# EAGLE design legatus_0_1 (EAGLE 9.6.2)
CNAME: Parrot Teensy Board; CREVISION: 1.0; DESIGNER: Nathan Villicana-Shaw

## Sheet 1 of 2
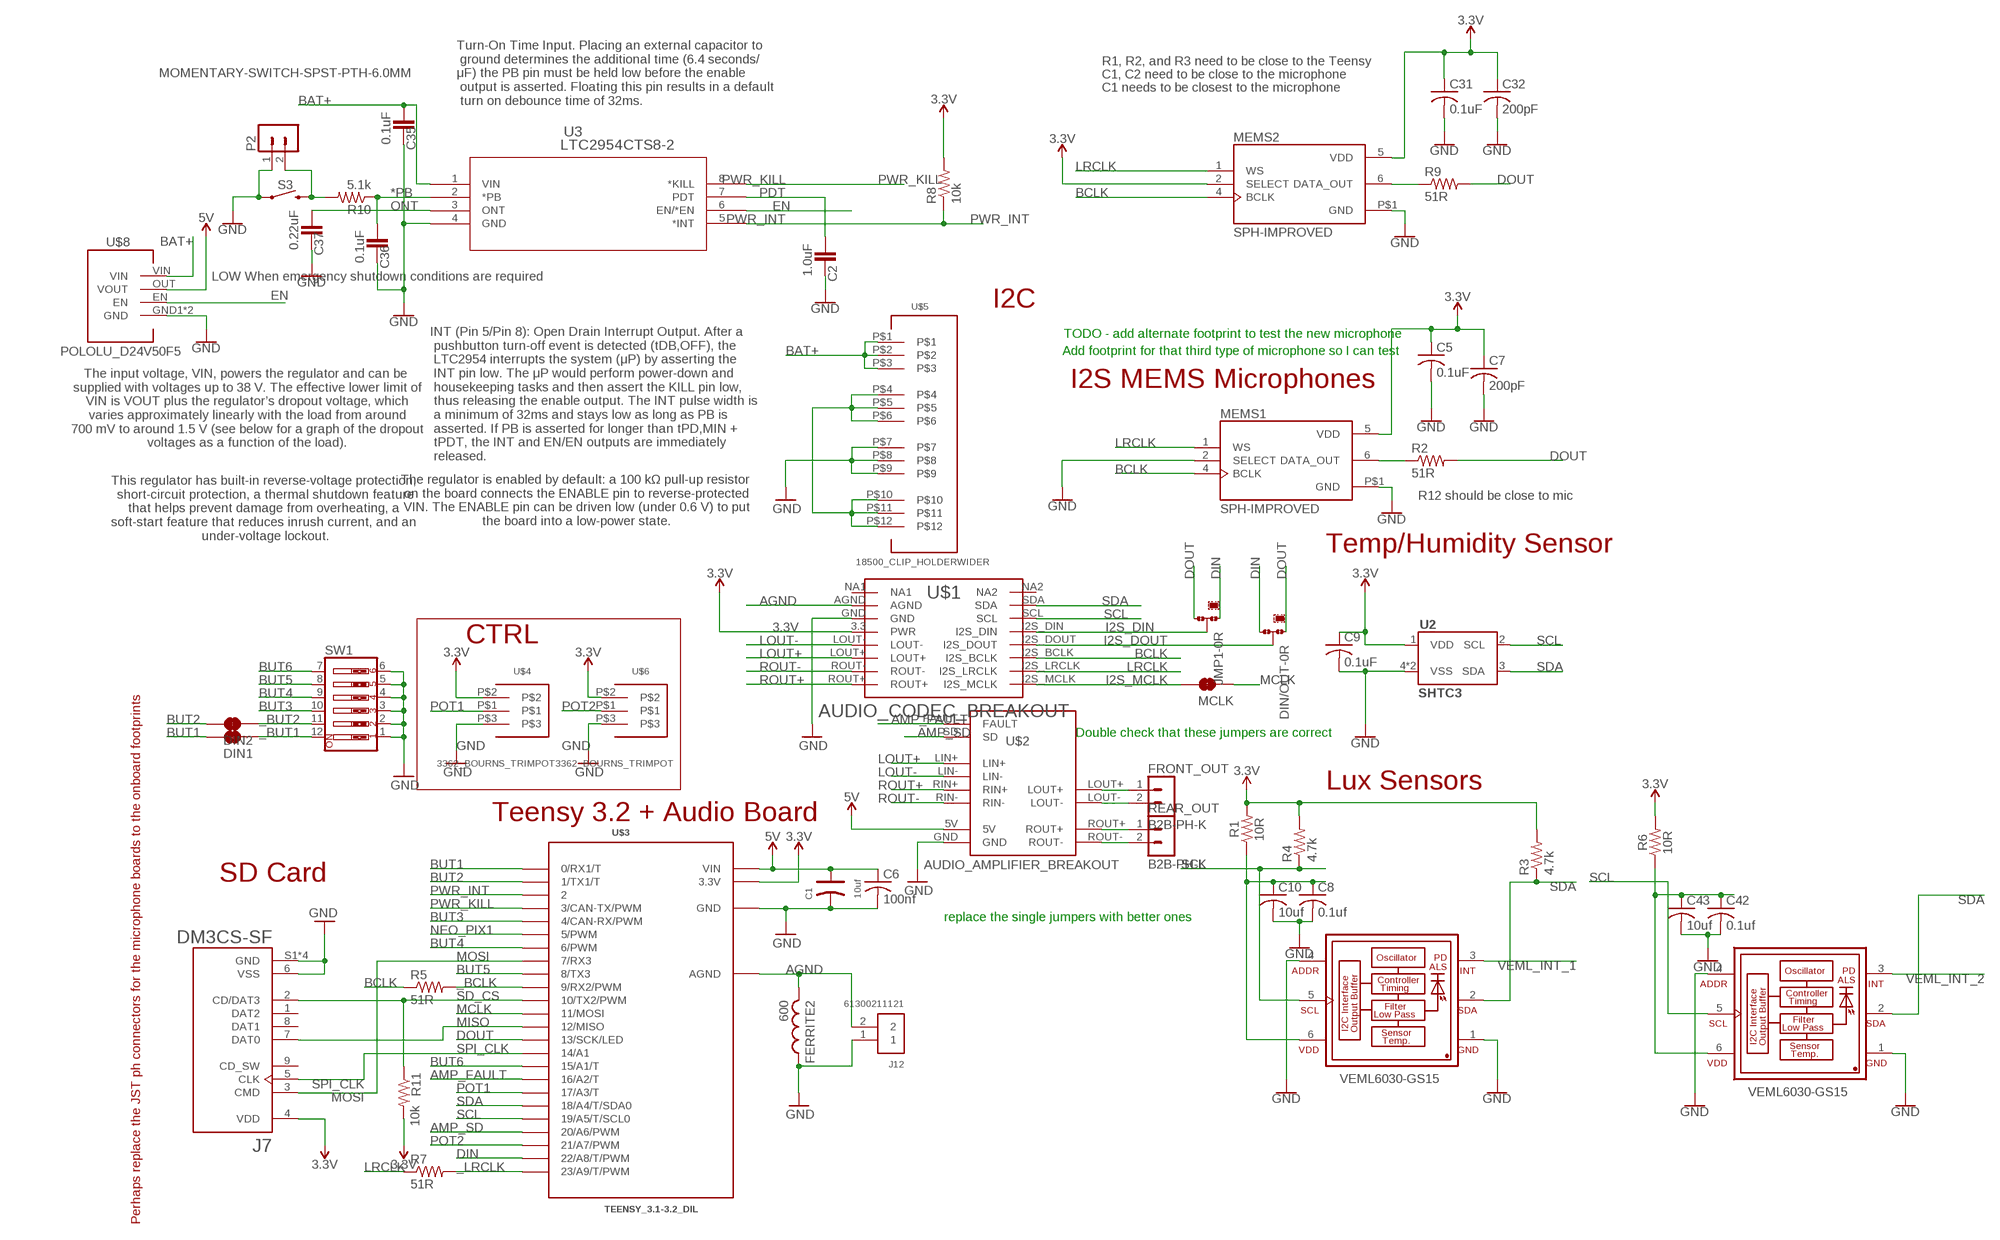
[diagram p0: schematic, sheet 1]

### Parts
C1  10uf  DIP-ALUMINUM-47UF-16V(D5-H7MM)  [PC-D5.3MM]
C2  1.0uF  C_CHIP-0805(2012-METRIC)  [CAPC2012X110]
C5  0.1uF  C-USC0805  [C0805]
C6  100nf  C-USC2012  [C2012]
C7  200pF  C-USC0805  [C0805]
C8  0.1uf  C-USC0805  [C0805]
C9  0.1uF  C-USC0805  [C0805]
C10  10uf  C-USC0805  [C0805]
C31  0.1uF  C-USC0805  [C0805]
C32  200pF  C-USC0805  [C0805]
C35  0.1uF  C_CHIP-0805(2012-METRIC)  [CAPC2012X110]
C36  0.1uF  C_CHIP-0805(2012-METRIC)  [CAPC2012X110]
C37  0.22uF  C_CHIP-0805(2012-METRIC)  [CAPC2012X110]
C42  0.1uf  C-USC0805  [C0805]
C43  10uf  C-USC0805  [C0805]
DIN1  JUMPER-SMT_2_NC_TRACE_SILK  [SMT-JUMPER_2_NC_TRACE_SILK]
DIN2  JUMPER-SMT_2_NC_TRACE_SILK  [SMT-JUMPER_2_NC_TRACE_SILK]
DIN/OUT  0R-JUMPB  [B0R-JMP]
FERRITE2  600  INDUCTOR_0805_N  [RESC0805_N]
FRONT_OUT  B2B-PH-K  [B2B-PH-K]
J7  DM3CS-SF  [HRS_DM3CS-SF]
J12  61300211121  [61300211121]
JMP1  0R-JUMPB  [B0R-JMP]
MCLK  JUMPER-SMT_2_NC_TRACE_SILK  [SMT-JUMPER_2_NC_TRACE_SILK]
MEMS1  SPH-IMPROVED  [MIC_SPH0645LM4H-B_LARGER_RING]
MEMS2  SPH-IMPROVED  [MIC_SPH0645LM4H-B_LARGER_RING]
P2  B2B-PH-K  [B2B-PH-K]
R1  10R  R-US_R0805  [R0805]
R2  51R  R-US_M0805  [M0805]
R3  4.7k  R-US_M0805  [M0805]
R4  4.7k  R-US_M0805  [M0805]
R5  51R  R-US_M0805  [M0805]
R6  10R  R-US_R0805  [R0805]
R7  51R  R-US_M0805  [M0805]
R8  10k  R-US_R0805  [R0805]
R9  51R  R-US_M0805  [M0805]
R10  5.1k  R-US_R0805  [R0805]
R11  10k  R-US_M0805  [M0805]
REAR_OUT  B2B-PH-K  [B2B-PH-K]
S3  MOMENTARY-SWITCH-SPST-PTH-6.0MM  [TACTILE_SWITCH_PTH_6.0MM]
SW1  SW_DIP-6  [EDG-06]
U2  SHTC3  [SHTC3]
U3  LTC2954CTS8-2  [TSOT-23_TS8]
U$1  AUDIO_CODEC_BREAKOUT  [HSS_CODEC_BREAKOUT]
U$2  AUDIO_AMPLIFIER_BREAKOUT  [AUDIO_AMPLIFIER_BREAKOUT]
U$3  TEENSY_3.1-3.2_DIL  [TEENSY_3.0-3.2&LC_DIL]
U$4  3362_BOURNS_TRIMPOT  [3362_BOURNS_TRIMPOT]
U$5  18500_CLIP_HOLDERWIDER  [3PINBATTERY_CLIP_WIDER]
U$6  3362_BOURNS_TRIMPOT  [3362_BOURNS_TRIMPOT]
U$8  POLOLU_D24V50F5  [POLOLU_D24V50F5]
VMEL1  VEML6030-GS15  [VISHAY_VEML6030_2X2X0.87]
VMEL2  VEML6030-GS15  [VISHAY_VEML6030_2X2X0.87]

### Nets
3.3V [3.3V]: C5.1 C7.1 C9.1 C31.1 C32.1 J7.4(VDD) MEMS1.5(VDD) MEMS2.2(SELECT) MEMS2.5(VDD) R1.2 R3.2 R4.2 R6.2 R8.2 R11.2 U2.1(VDD) U$1.3.3(PWR) U$3.3.3V U$4.P$2 U$6.P$2
5V: C1.+ C6.1 U$2.5V U$3.VIN U$8.OUT(VOUT) ; also sheet 2
*PB: P2.2 R10.2 S3.3
_BCLK: R5.2 U$3.9(9/RX2/PWM)
_BUT1: DIN1.2 SW1.12
_BUT2: DIN2.2 SW1.11
_LRCLK: R7.2 U$3.23/A9(23/A9/T/PWM)
AGND [AGND]: FERRITE2.2 J12.2 U$1.AGND U$3.AGND
AMP_FAULT: U$2.FAULT U$3.16/A2(16/A2/T)
AMP_SD: U$2.SD U$3.20/A6(20/A6/PWM)
BAT+: C35.1 U3.1(VIN) U$5.P$1 U$5.P$2 U$5.P$3 U$8.VIN
BCLK: MEMS1.4(BCLK) MEMS2.4(BCLK) R5.1 U$1.I2S_BCLK
BUT1: DIN1.1 U$3.0(0/RX1/T)
BUT2: DIN2.1 U$3.1(1/TX1/T)
BUT3: SW1.10 U$3.4(4/CAN-RX/PWM)
BUT4: SW1.9 U$3.6(6/PWM)
BUT5: SW1.8 U$3.8(8/TX3)
BUT6: SW1.7 U$3.15/A1(15/A1/T)
DIN: DIN/OUT.3 JMP1.1 U$3.22/A8(22/A8/T/PWM)
DOUT: DIN/OUT.1 JMP1.3 R2.2 R9.2 U$3.13(13/SCK/LED)
EN: U3.6(EN/*EN) U$8.EN
GND: C1.- C2.2 C5.2 C6.2 C7.2 C8.2 C9.2 C10.2 C31.2 C32.2 C35.2 C36.2 C37.2 C42.2 C43.2 FERRITE2.1 J7.6(VSS) J7.S1(GND) J7.S2(GND) J7.S3(GND) J7.S5(GND) J12.1 MEMS1.2(SELECT) MEMS1.P$1(GND) MEMS2.P$1(GND) P2.1 S3.1 SW1.1 SW1.2 SW1.3 SW1.4 SW1.5 SW1.6 U2.4(VSS) U2.5(VSS) U3.4(GND) U$1.GND U$2.GND U$3.GND U$4.P$3 U$5.P$7 U$5.P$8 U$5.P$9 U$6.P$3 U$8.GND1(GND) U$8.GND2(GND) VMEL1.1(GND) VMEL1.4(ADDR) VMEL2.1(GND) VMEL2.4(ADDR) ; also sheet 2
I2S_DIN: JMP1.2 U$1.I2S_DIN
I2S_DOUT: DIN/OUT.2 U$1.I2S_DOUT
I2S_MCLK: MCLK.1 U$1.I2S_MCLK
LOUT+: U$1.LOUT+ U$2.LIN+
LOUT-: U$1.LOUT- U$2.LIN-
LRCLK: MEMS1.1(WS) MEMS2.1(WS) R7.1 U$1.I2S_LRCLK
MCLK: MCLK.2 U$3.11(11/MOSI)
MISO: J7.7(DAT0) U$3.12(12/MISO)
MOSI: J7.3(CMD) U$3.7(7/RX3)
N$1: MEMS1.6(DATA_OUT) R2.1
N$2: U$5.P$4 U$5.P$5 U$5.P$6 U$5.P$10 U$5.P$11 U$5.P$12
N$4: C8.1 C10.1 R1.1 VMEL1.6(VDD)
N$6: C36.1 R10.1 U3.2(*PB)
N$28: MEMS2.6(DATA_OUT) R9.1
N$30: REAR_OUT.2 U$2.ROUT-
N$31: REAR_OUT.1 U$2.ROUT+
N$32: FRONT_OUT.2 U$2.LOUT-
N$33: FRONT_OUT.1 U$2.LOUT+
N$41: C42.1 C43.1 R6.1 VMEL2.6(VDD)
NEO_PIX1: U$3.5(5/PWM) ; also sheet 2
ONT: C37.1 U3.3(ONT)
PDT: C2.1 U3.7(PDT)
POT1: U$3.17/A3(17/A3/T) U$4.P$1
POT2: U$3.21/A7(21/A7/PWM) U$6.P$1
PWR_INT: R8.1 U3.5(*INT) U$3.2
PWR_KILL: U3.8(*KILL) U$3.3(3/CAN-TX/PWM)
ROUT+: U$1.ROUT+ U$2.RIN+
ROUT-: U$1.ROUT- U$2.RIN-
SCL: R4.1 U2.2(SCL) U$1.SCL U$3.19/A5(19/A5/T/SCL0) VMEL1.5(SCL) VMEL2.5(SCL)
SD_CS: J7.2(CD/DAT3) R11.1 U$3.10(10/TX2/PWM)
SDA: R3.1 U2.3(SDA) U$1.SDA U$3.18/A4(18/A4/T/SDA0) VMEL1.2(SDA) VMEL2.2(SDA)
SPI_CLK: J7.5(CLK) U$3.14/A0(14/A1)
VEML_INT_1: VMEL1.3(INT)
VEML_INT_2: VMEL2.3(INT)
Unconnected: J7.1(DAT2) J7.8(DAT1) J7.9(CD_SW) U$1.NA1 U$1.NA2

### Notes on the sheet
- R1, R2, and R3 need to be close to the Teensy
- C1, C2 need to be close to the microphone
- C1 needs to be closest to the microphone
- Turn-On Time Input. Placing an external capacitor to
   ground determines the additional time (6.4 seconds/
  μF) the PB pin must be held low before the enable
   output is asserted. Floating this pin results in a default
   turn on debounce time of 32ms.
- LOW When emergency shutdown conditions are required
- I2C
- TODO - add alternate footprint to test the new microphone
- Add footprint for that third type of microphone so I can test
- I2S MEMS Microphones
- The input voltage, VIN, powers the regulator and can be
   supplied with voltages up to 38 V. The effective lower limit of
   VIN is VOUT plus the regulator’s dropout voltage, which
   varies approximately linearly with the load from around
   700 mV to around 1.5 V (see below for a graph of the dropout
   voltages as a function of the load).
- INT (Pin 5/Pin 8): Open Drain Interrupt Output. After a
   pushbutton turn-off event is detected (tDB,OFF), the
   LTC2954 interrupts the system (μP) by asserting the
   INT pin low. The μP would perform power-down and
   housekeeping tasks and then assert the KILL pin low,
   thus releasing the enable output. The INT pulse width is
   a minimum of 32ms and stays low as long as PB is
   asserted. If PB is asserted for longer than tPD,MIN +
   tPDT, the INT and EN/EN outputs are immediately
   released.
- The regulator is enabled by default: a 100 kΩ pull-up resistor
   on the board connects the ENABLE pin to reverse-protected
   VIN. The ENABLE pin can be driven low (under 0.6 V) to put
   the board into a low-power state.
- R12 should be close to mic
- This regulator has built-in reverse-voltage protection, 
  short-circuit protection, a thermal shutdown feature
  that helps prevent damage from overheating, a 
  soft-start feature that reduces inrush current, and an 
  under-voltage lockout.
- Temp/Humidity Sensor
- CTRL
- Double check that these jumpers are correct
- Lux Sensors
- Teensy 3.2 + Audio Board
- 10R
- 10R
- SD Card
- replace the single jumpers with better ones
- Perhaps replace the JST ph connectors for the microphone boards to the onboard footprints

## Sheet 2 of 2: Neopixel LEDs
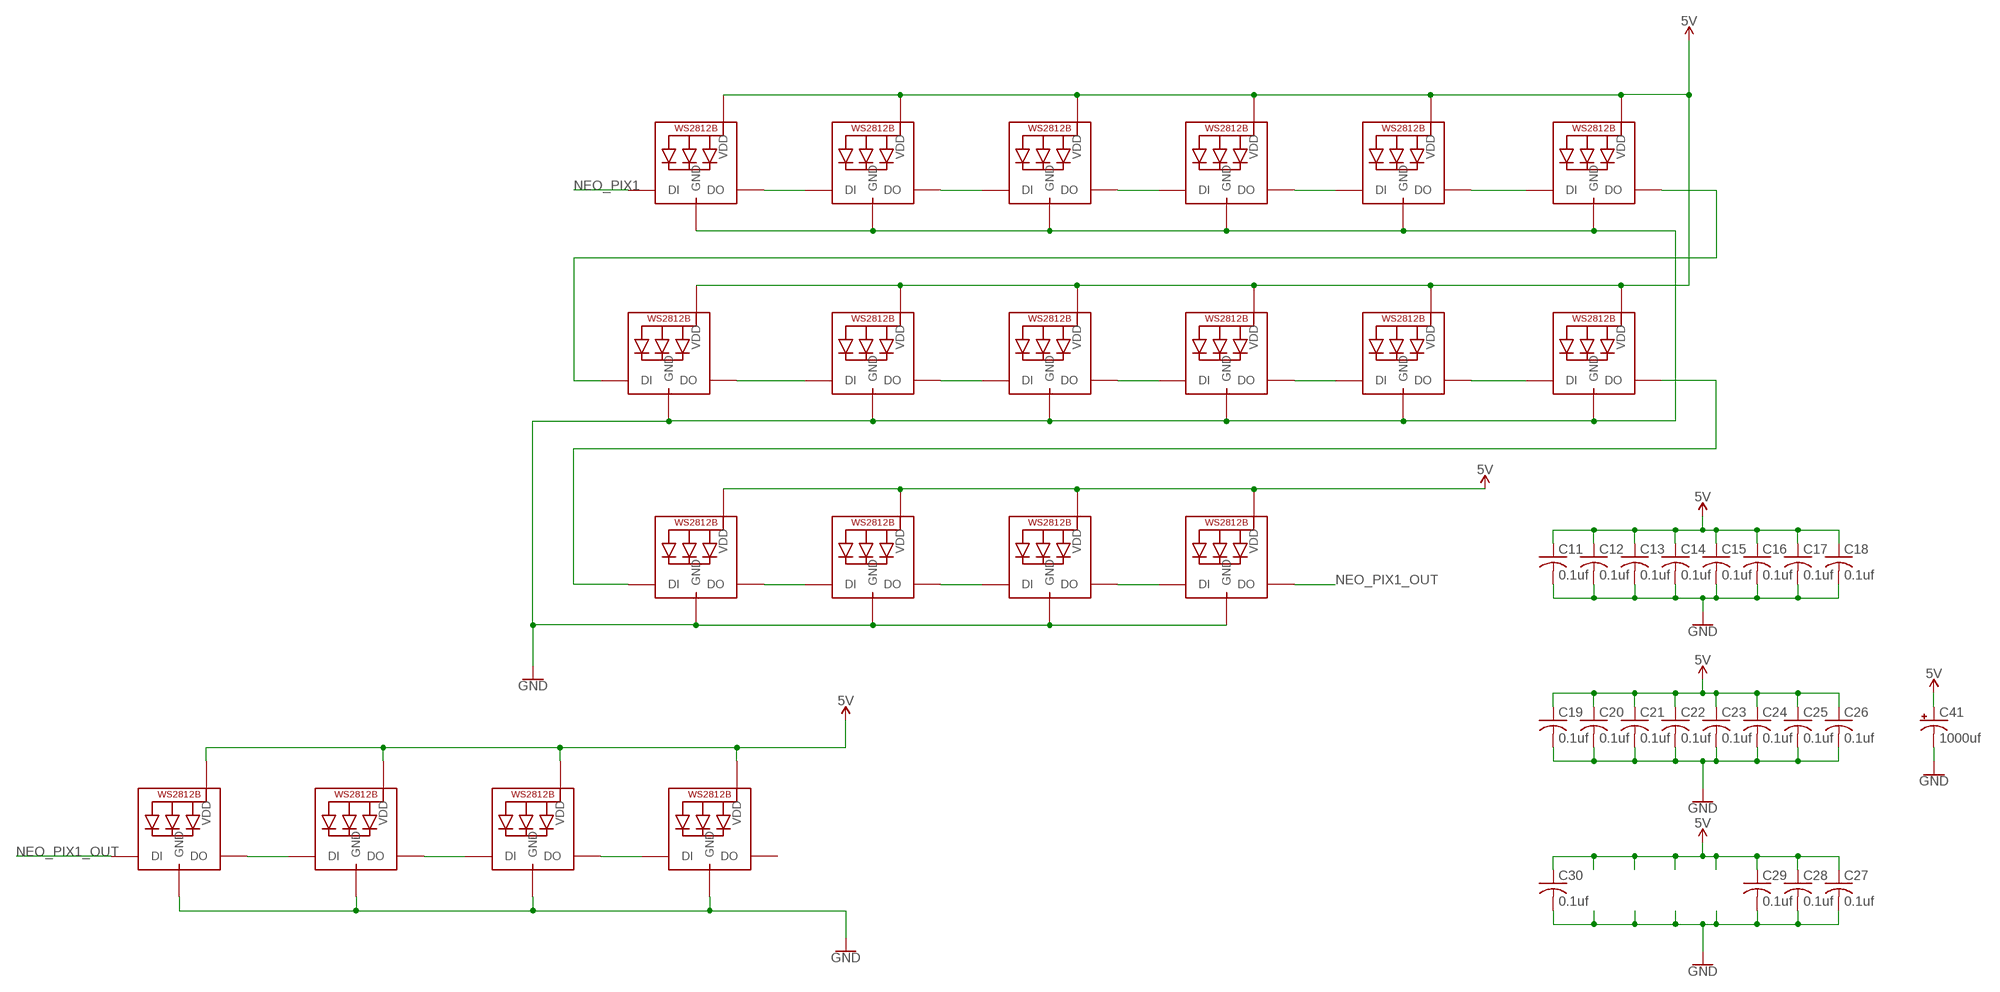
[diagram p1: schematic, sheet 2]

### Parts
C11  0.1uf  C-USC0805  [C0805]
C12  0.1uf  C-USC0805  [C0805]
C13  0.1uf  C-USC0805  [C0805]
C14  0.1uf  C-USC0805  [C0805]
C15  0.1uf  C-USC0805  [C0805]
C16  0.1uf  C-USC0805  [C0805]
C17  0.1uf  C-USC0805  [C0805]
C18  0.1uf  C-USC0805  [C0805]
C19  0.1uf  C-USC0805  [C0805]
C20  0.1uf  C-USC0805  [C0805]
C21  0.1uf  C-USC0805  [C0805]
C22  0.1uf  C-USC0805  [C0805]
C23  0.1uf  C-USC0805  [C0805]
C24  0.1uf  C-USC0805  [C0805]
C25  0.1uf  C-USC0805  [C0805]
C26  0.1uf  C-USC0805  [C0805]
C27  0.1uf  C-USC0805  [C0805]
C28  0.1uf  C-USC0805  [C0805]
C29  0.1uf  C-USC0805  [C0805]
C30  0.1uf  C-USC0805  [C0805]
C41  1000uf  CPOL-US153CLV-1010  [153CLV-1010]
LED1  WS2812B_5050N  [WS2812B-NARROW]
LED2  WS2812B_5050N  [WS2812B-NARROW]
LED3  WS2812B_5050N  [WS2812B-NARROW]
LED4  WS2812B_5050N  [WS2812B-NARROW]
LED5  WS2812B_5050N  [WS2812B-NARROW]
LED6  WS2812B_5050N  [WS2812B-NARROW]
LED7  WS2812B_5050N  [WS2812B-NARROW]
LED8  WS2812B_5050N  [WS2812B-NARROW]
LED9  WS2812B_5050N  [WS2812B-NARROW]
LED10  WS2812B_5050N  [WS2812B-NARROW]
LED11  WS2812B_5050N  [WS2812B-NARROW]
LED12  WS2812B_5050N  [WS2812B-NARROW]
LED13  WS2812B_5050N  [WS2812B-NARROW]
LED14  WS2812B_5050N  [WS2812B-NARROW]
LED15  WS2812B_5050N  [WS2812B-NARROW]
LED16  WS2812B_5050N  [WS2812B-NARROW]
LED17  WS2812B_5050N  [WS2812B-NARROW]
LED18  WS2812B_5050N  [WS2812B-NARROW]
LED19  WS2812B_5050N  [WS2812B-NARROW]
LED20  WS2812B_5050N  [WS2812B-NARROW]

### Nets
5V: C11.1 C12.1 C13.1 C14.1 C15.1 C16.1 C17.1 C18.1 C19.1 C20.1 C21.1 C22.1 C23.1 C24.1 C25.1 C26.1 C27.1 C28.1 C29.1 C30.1 C41.+ LED1.1-VDD(VDD) LED2.1-VDD(VDD) LED3.1-VDD(VDD) LED4.1-VDD(VDD) LED5.1-VDD(VDD) LED6.1-VDD(VDD) LED7.1-VDD(VDD) LED8.1-VDD(VDD) LED9.1-VDD(VDD) LED10.1-VDD(VDD) LED11.1-VDD(VDD) LED12.1-VDD(VDD) LED13.1-VDD(VDD) LED14.1-VDD(VDD) LED15.1-VDD(VDD) LED16.1-VDD(VDD) LED17.1-VDD(VDD) LED18.1-VDD(VDD) LED19.1-VDD(VDD) LED20.1-VDD(VDD) ; also sheet 1
GND: C11.2 C12.2 C13.2 C14.2 C15.2 C16.2 C17.2 C18.2 C19.2 C20.2 C21.2 C22.2 C23.2 C24.2 C25.2 C26.2 C27.2 C28.2 C29.2 C30.2 C41.- LED1.3-GND(GND) LED2.3-GND(GND) LED3.3-GND(GND) LED4.3-GND(GND) LED5.3-GND(GND) LED6.3-GND(GND) LED7.3-GND(GND) LED8.3-GND(GND) LED9.3-GND(GND) LED10.3-GND(GND) LED11.3-GND(GND) LED12.3-GND(GND) LED13.3-GND(GND) LED14.3-GND(GND) LED15.3-GND(GND) LED16.3-GND(GND) LED17.3-GND(GND) LED18.3-GND(GND) LED19.3-GND(GND) LED20.3-GND(GND) ; also sheet 1
N$9: LED1.2-DOUT(DO) LED2.4-DIN(DI)
N$10: LED2.2-DOUT(DO) LED3.4-DIN(DI)
N$11: LED3.2-DOUT(DO) LED4.4-DIN(DI)
N$12: LED4.2-DOUT(DO) LED5.4-DIN(DI)
N$13: LED5.2-DOUT(DO) LED6.4-DIN(DI)
N$14: LED7.2-DOUT(DO) LED8.4-DIN(DI)
N$15: LED8.2-DOUT(DO) LED9.4-DIN(DI)
N$16: LED9.2-DOUT(DO) LED10.4-DIN(DI)
N$17: LED10.2-DOUT(DO) LED11.4-DIN(DI)
N$18: LED11.2-DOUT(DO) LED12.4-DIN(DI)
N$19: LED13.2-DOUT(DO) LED14.4-DIN(DI)
N$20: LED14.2-DOUT(DO) LED15.4-DIN(DI)
N$21: LED15.2-DOUT(DO) LED16.4-DIN(DI)
N$23: LED12.2-DOUT(DO) LED13.4-DIN(DI)
N$24: LED6.2-DOUT(DO) LED7.4-DIN(DI)
N$26: LED18.2-DOUT(DO) LED19.4-DIN(DI)
N$29: LED19.2-DOUT(DO) LED20.4-DIN(DI)
N$43: LED17.2-DOUT(DO) LED18.4-DIN(DI)
NEO_PIX1: LED1.4-DIN(DI) ; also sheet 1
NEO_PIX1_OUT: LED16.2-DOUT(DO) LED17.4-DIN(DI)
Unconnected: LED20.2-DOUT(DO)

## Library data of the parts
C1 = Seeed-Capacitor:DIP-ALUMINUM-47UF-16V(D5-H7MM): 302030033; MPN: KS 100uF/16V; VALUE: 100uf
C2 C35-C37 = Capacitor:C: Capacitor - Generic; CATEGORY: Capacitor
C5 C7-C32 C42 C43 = rcl:C-US: CAPACITOR, American symbol; SPICEPREFIX: C
C6 = adafruit:C-US: CAPACITOR, American symbol
C41 = adafruit:CPOL-US: POLARIZED CAPACITOR, American symbol
DIN1 DIN2 MCLK = SparkFun-Jumpers:JUMPER-SMT_2_NC_TRACE: Normally closed trace jumper This jumper has a trace between two pads so it's normally closed (NC). Use a razor knife to open the connection. For best results follow the IPC guidelines for cutting traces: Cutout at least 0.063 mm (0.005 in). Remove all loose material to clean up the cut area. Seal the cut with an approved epoxy. Reapply solder to reclose the connection.
DIN/OUT JMP1 = jump-0r-smd:0R-JUMP: SMD 0R 0805 Jumper
FERRITE2 = Nordic_nRF:INDUCTOR: Generic chip inductor
FRONT_OUT P2 REAR_OUT = con-jst-ph:B2B-PH-K: HEADER
J7 = DM3CS-SF:DM3CS-SF: CONN MICRO SD CARD HINGED TYPE; AVAILABILITY: Unavailable; DESCRIPTION: 10 (8 + 2) Position Card Connector Secure Digital - microSD™ Surface Mount, Right Angle Gold; MF: Hirose; MP: DM3CS-SF; PACKAGE: None; PRICE: None
J12 = Headers:61300211121: CONN HEADER VERT 2POS 2.54MM Manufacturer's datasheet <https://katalog.we-online.de/em/datasheet/6130xx11121.pdf>; CREATED_BY: PCBLayout.com; DIGI_KEY_PART_NUMBER: 732-5315-ND; MANUFACTURER: Wurth Electronics Inc.; MPN: 61300211121
LED1-LED20 = nathans-custom-parts:WS2812B
MEMS1 MEMS2 = SPH0645LM4H-B:SPH-IMPROVED
R1 R6 = audio amplifier example:R-US_: RESISTOR, American symbol
R2-R5 R7 R9 = adafruit:R-US_: RESISTOR, American symbol
R8 R10 = adafruit-with-additions:R-US_: RESISTOR, American symbol
R11 = rcl:R-US_: RESISTOR, American symbol; SPICEPREFIX: R
S3 = SparkFun-Switches:MOMENTARY-SWITCH-SPST: Momentary Switch (Pushbutton) - SPST Normally-open (NO) SPST momentary switches (buttons, pushbuttons). Variants PTH-12MM - 12mm square, through-hole Momentary Pushbutton Switch - 12mm Square <https://www.sparkfun.com/products/9190> (COM-09190) PTH-6.0MM, PTH-6.0MM-KIT - 6.0mm square, through-hole Mini Pushbutton Switch <https://www.sparkfun.com/products/97> (COM-00097) KIT package intended for soldering kit's - only one side of pads' copper is exposed. PTH-RIGHT-ANGLE-KIT - Right-angle, through-hole Right Angle Tactile Button <https://www.sparkfun.com/products/10791> - Used on SparkFun BigTime Watch Kit <https://www.sparkfun.com/products/11734> SMD-12MM - 12mm square, surface-mount Tactile Button - SMD (12mm) <https://www.sparkfun.com/products/12993> (COM-12993) Used on SparkFun PicoBoard <https://www.sparkfun.com/products/11888> SMD-4.5MM - 4.5mm Square Trackball Switch Used on SparkFun Blackberry Trackballer Breakout <https://www.sparkfun.com/products/13169> SMD-4.6MMX2.8MM - 4.60mm x 2.80mm, surface mount Used on SparkFun SAMD21 Mini Breakout <https://www.sparkfun.com/products/13664> SMD-5.2MM, SMD-5.2-REDUNDANT - 5.2mm square, surface-mount Mini Pushbutton Switch - SMD <https://www.sparkfun.com/products/8720> (COM-08720) Used on Arduino Pro Mini <https://www.sparkfun.com/products/11114> REDUNDANT package connects both switch circuits together SMD-6.0X3.5MM - 6.0 x 3.5mm, surface mount Momentary Reset Switch SMD <https://www.sparkfun.com/products/8229> (COM-08229) SMD-6.2MM-TALL - 6.2mm square, surface mount Tactile Button - SMD (6mm) <https://www.sparkfun.com/products/12992> Used on SparkFun Digital Sandbox <https://www.sparkfun.com/products/12651> SMD-RIGHT-ANGLE - Right-angle, surface mount Used on SparkFun Block for Intel® Edison - Arduino <https://www.sparkfun.com/products/13036>; PROD_ID: SWCH-08441; SF_SKU: COM-00097
SW1 = special:SW_DIP-6: DIP SWITCH
U2 = SHTC3:SHTC3
U3 = LTC2954CTS8-2:LTC2954CTS8-2: Check prices <https://pricing.snapeda.com/parts/LTC2954CTS8-2/Analog%20Devices%20/%20Linear%20Technology/view-part?ref=eda>; AVAILABILITY: Bad; DESCRIPTION: Power Supply Controller Push Button, On/Off Controller TSOT-23-8; MF: Analog Devices / Linear Technology; MP: LTC2954CTS8-2; PACKAGE: None; PRICE: None
U$1 = nathans-custom-parts:AUDIO_CODEC_BREAKOUT
U$2 = nathans-custom-parts:AUDIO_AMPLIFIER_BREAKOUT
U$3 = teensy_3_and_LC:TEENSY_3.1-3.2_DIL: Teensy 3.1 or 3.2 in a DIL Layout.
U$4 U$6 = nathans-custom-parts:3362_BOURNS_TRIMPOT
U$5 = nathans-custom-parts:18500_CLIP_HOLDER
U$8 = nathans-custom-parts:POLOLU_D24V50F5
VMEL1 VMEL2 = VEML6030-GS15:VEML6030-GS15: VEML6030 High Accuracy Ambient Light Sensor with I2C Interface: VEML6030 is a high accuracy ambient light digital 16-bit resolution sensor in a miniature transparent 2 mm x 2 mm package. It includes a high sensitive photodiode, a low noise amplifier, a 16-bit A/D converter and supports an easy to use I2C bus communication interface and additional interrupt feature. The ambient light result is as digital value available. Device Model created 15.06.2016 by Johannes Kolb - Vishay Semiconductor GmbH; AVAILABILITY: Unavailable; DESCRIPTION: Optical Sensor Ambient 550nm I²C 6-SMD, No Lead; MF: Vishay Semiconductor; MP: VEML6030-GS15; PACKAGE: SMD-6 Vishay; PRICE: None

## Net classes
0 default: width 0.203 mm, drill 0.254 mm, clearance 0.203 mm
1 12V_IN: width 1.016 mm, drill 0.762 mm, clearance 0.305 mm
2 3.3V: width 0.305 mm, drill 0.508 mm, clearance 0.254 mm
3 5V: width 0.787 mm, drill 0.508 mm, clearance 0.381 mm
4 AGND: width 0.406 mm, drill 0.203 mm, clearance 0.203 mm

## Board
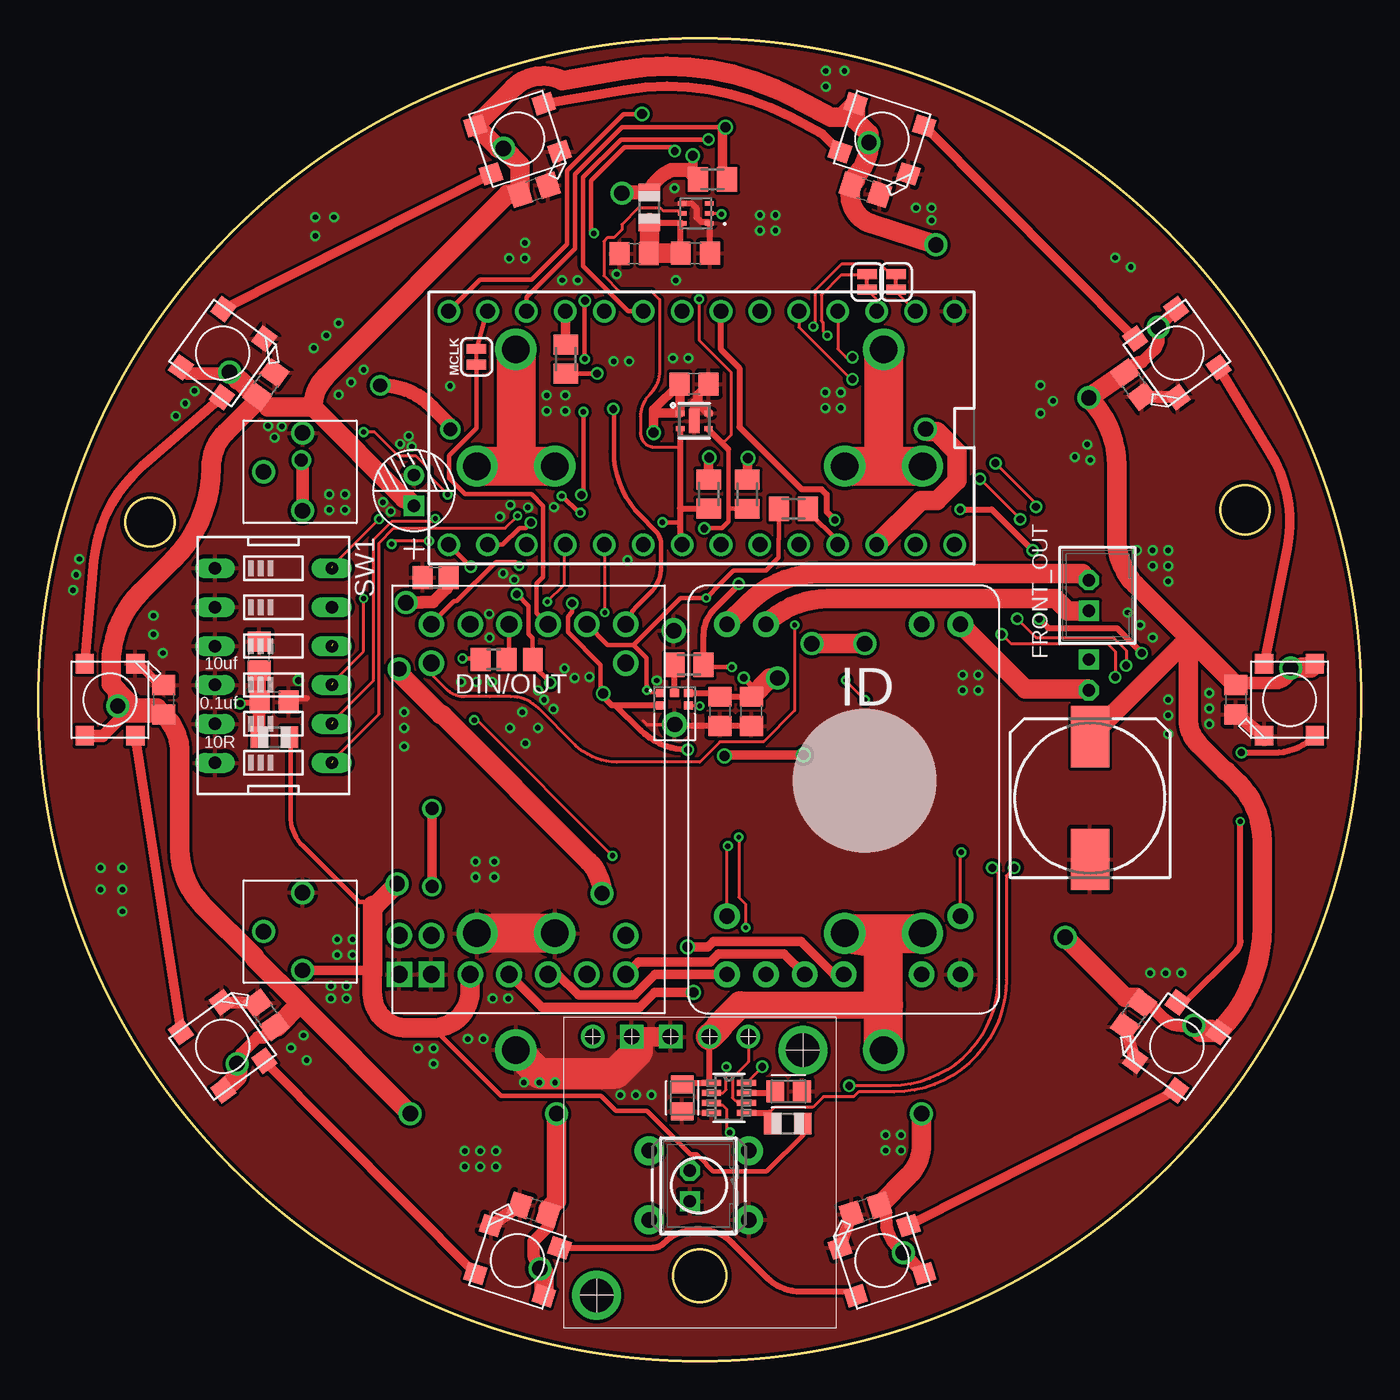
[diagram p2: board, top side]
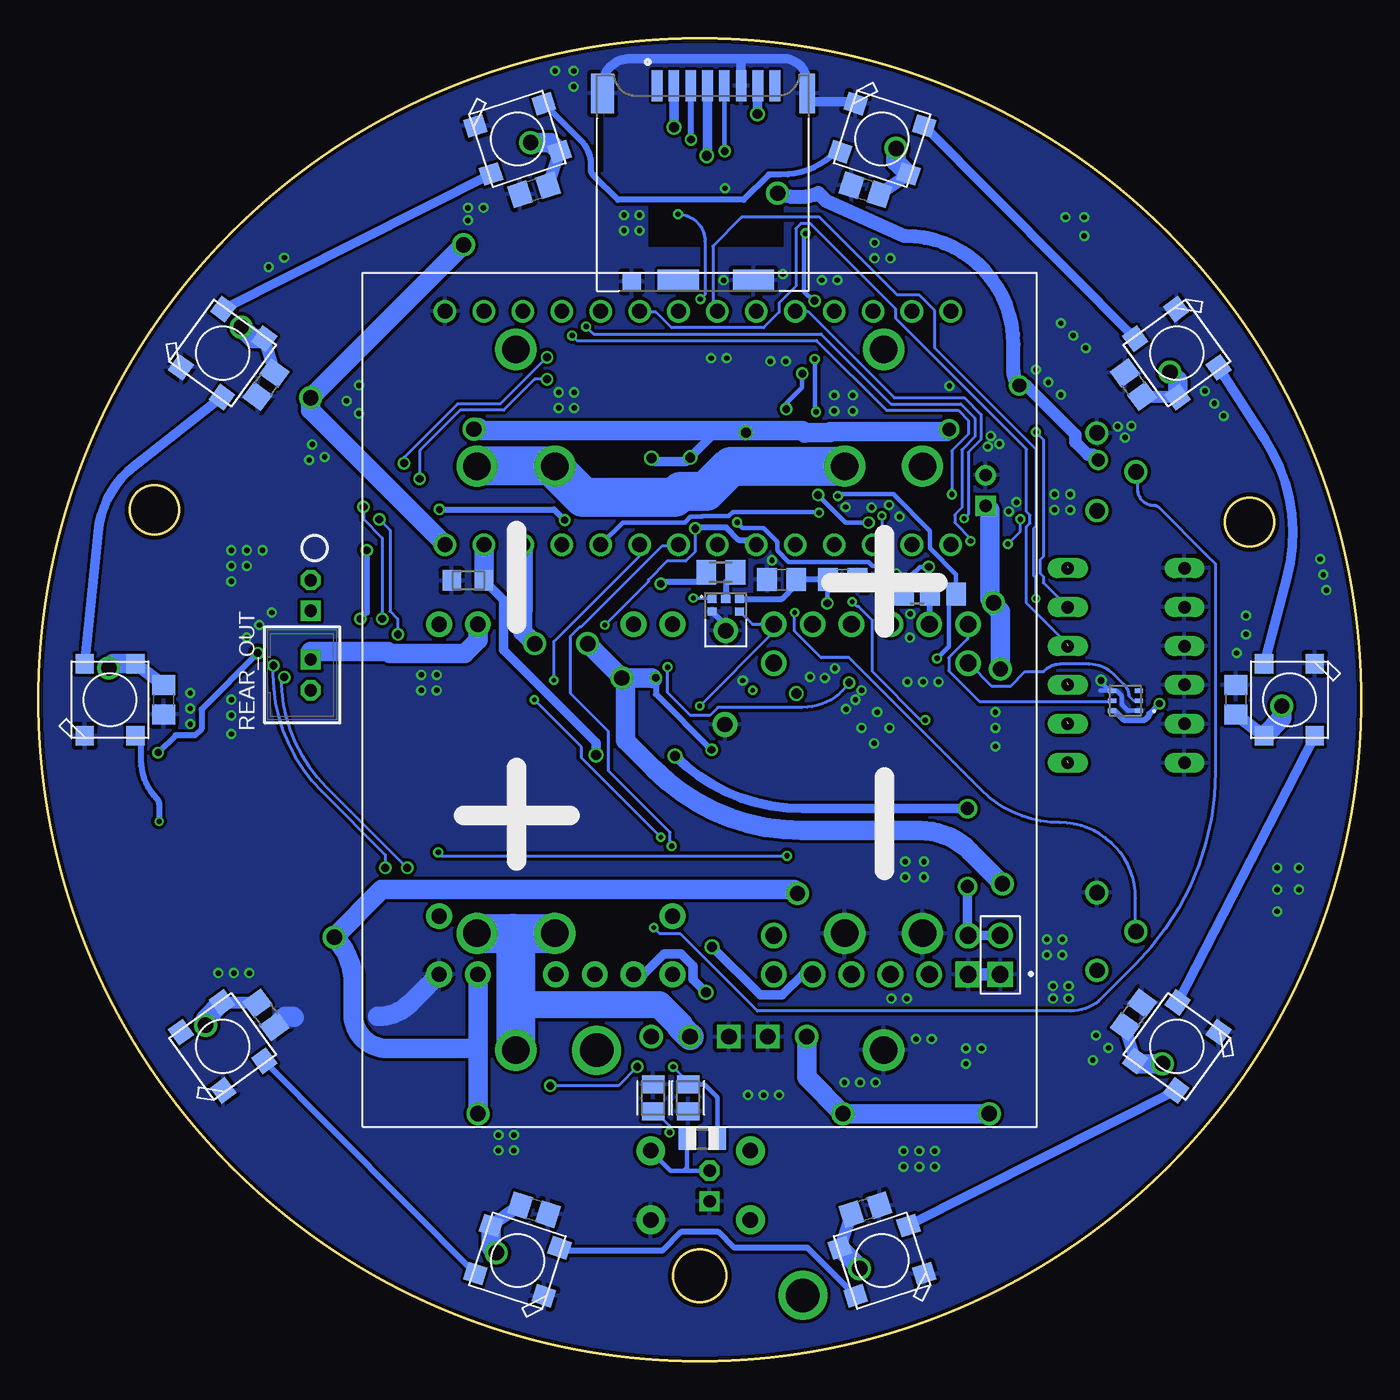
[diagram p3: board, bottom side, seen from below]

Size 86.36 x 86.36 mm. Coordinates in mm from the lower left corner, seen from the top.
Outline: circle at 43.18,43.18 radius 43.18
Outline: circle at 43.18,5.58 radius 1.73
Outline: circle at 7.28,54.78 radius 1.6
Outline: circle at 78.78,55.58 radius 1.6
Copper layers (1*16): Top 0.035mm / dielectric 1.5mm / Bottom 0.035mm
Design rules "SeeedStudio_2layer_DRU_no_angle_20140221": minimum track width 6mil, minimum drill 12mil, track to track 6mil, track to pad 6mil, pad to pad 6mil, via to via 6mil, smd to smd 0mil, copper to edge 10mil, drill to drill 10mil, minimum pad ring 10mil, minimum via ring 6mil, stop-mask expansion 2mil, vias tented up to drill 100mil, thermal gap 10mil

### Footprints (pad centres in the part's own frame; a part is rotated, then mirrored left to right if it is on the bottom)
PC-D5.3MM = drill 0.8 pad 1.35 square: + -1,0 | drill 0.8 pad 1.35: - 1,0
CAPC2012X110 = smd 1.165 x 1.465: 1 -0.875,0; 2 0.875,0
C0805 = smd 1.3 x 1.5: 1 -0.95,0; 2 0.95,0
C2012 = smd 1.3 x 1.5: 1 -0.85,0; 2 0.85,0
153CLV-1010 = smd 4 x 2.5: + 4,0; - -4,0
SMT-JUMPER_2_NC_TRACE_SILK = smd 0.635 x 1.27: 1 -0.508,0; 2 0.508,0
B0R-JMP = smd 1.5 x 1.3: 1 0,1.7; 2 0,0; 3 0,-1.7
RESC0805_N = smd 1.2 x 1.35: 1 -1.1,0; 2 1,0
B2B-PH-K = drill 0.813 square: 1 -1,0 | drill 0.813 octagon: 2 1,0
HRS_DM3CS-SF = smd 0.7 x 2: 1 3.2,-6.35; 2 2.1,-6.35; 3 1,-6.35; 4 -0.1,-6.35; 5 -1.2,-6.35; 6 -2.3,-6.35; 7 -3.4,-6.35; 8 -4.5,-6.35 | smd 2.7 x 1.4: 9 1.8,6.35; S3 -3.1,6.35 | smd 1 x 2.6: S1 -6.6,-5.85 | smd 1.5 x 2.6: S2 6.75,-5.85 | smd 1.2 x 1.2: S5 4.85,6.45
61300211121 = drill 1.1 square: 1 -1.27,0 | drill 1.1: 2 1.27,0
WS2812B-NARROW = smd 1.3 x 1.2: 1-VDD 2.35,-1.65; 2-DOUT 2.35,1.65; 3-GND -2.35,1.65; 4-DIN -2.35,-1.65
MIC_SPH0645LM4H-B_LARGER_RING = smd 0.6 x 0.522: 1 -0.9,2.074; 2 -0.9,1.252; 4 0.9,1.252; 5 0.9,2.074; 6 0,2.074 | drill 1 pad 1.626: P$1 0,0
R0805 = smd 1.1 x 1.4: 1 -1,0; 2 1,0
M0805 = smd 1.3 x 1.6: 1 -0.95,0; 2 0.95,0
TACTILE_SWITCH_PTH_6.0MM = drill 1.016 pad 1.88: 1 -3.251,2.261; 2 3.251,2.261; 3 -3.251,-2.261; 4 3.251,-2.261
EDG-06 = drill 0.813 long: 1 -6.35,-3.81; 2 -3.81,-3.81; 3 -1.27,-3.81; 4 1.27,-3.81; 5 3.81,-3.81; 6 6.35,-3.81; 7 6.35,3.81; 8 3.81,3.81; 9 1.27,3.81; 10 -1.27,3.81; 11 -3.81,3.81; 12 -6.35,3.81
SHTC3 = smd 0.55 x 0.35: 1 -0.925,0.5; 2 -0.925,-0.5; 3 0.925,-0.5; 4 0.925,0.5 | smd 0.7 x 1.6: 5 0,0
TSOT-23_TS8 = smd 1.219 x 0.406: 1 -1.143,0.975; 2 -1.143,0.325; 3 -1.143,-0.325; 4 -1.143,-0.975; 5 1.143,-0.975; 6 1.143,-0.325; 7 1.143,0.325; 8 1.143,0.975
HSS_CODEC_BREAKOUT = drill 1.1 pad 1.676: 3.3 -11.43,3.81; AGND -8.89,6.35; I2S_BCLK 11.43,-6.35; I2S_DIN 11.43,3.81; I2S_DOUT 11.43,1.27; I2S_LRCLK 11.43,-3.81; I2S_MCLK 11.43,-1.27; LOUT+ -11.43,-1.27; LOUT- -11.43,1.27; NA1 -8.89,-6.35; NA2 8.89,-6.35; ROUT+ -11.43,-6.35; ROUT- -11.43,-3.81; SCL 11.43,6.35; SDA 8.89,6.35 | drill 1.1 pad 1.676 square: GND -11.43,6.35
AUDIO_AMPLIFIER_BREAKOUT = drill 1 pad 1.676: 5V -5.08,11.43; FAULT -7.62,7.62; GND -7.62,11.43; LIN+ 7.62,11.43; LIN- 5.08,11.43; LOUT+ 5.08,-11.43; LOUT- 7.62,-11.43; RIN+ 2.54,11.43; RIN- 0,11.43; ROUT+ -5.08,-11.43; ROUT- -7.62,-11.43; SD 7.62,7.62
TEENSY_3.0-3.2&LC_DIL = drill 0.965: 0 -7.62,13.97; 1 -7.62,11.43; 2 -7.62,8.89; 3 -7.62,6.35; 3.3V 7.62,11.43; 4 -7.62,3.81; 5 -7.62,1.27; 6 -7.62,-1.27; 7 -7.62,-3.81; 8 -7.62,-6.35; 9 -7.62,-8.89; 10 -7.62,-11.43; 11 -7.62,-13.97; 12 -7.62,-16.51; 13 7.62,-16.51; 14/A0 7.62,-13.97; 15/A1 7.62,-11.43; 16/A2 7.62,-8.89; 17/A3 7.62,-6.35; 18/A4 7.62,-3.81; 19/A5 7.62,-1.27; 20/A6 7.62,1.27; 21/A7 7.62,3.81; 22/A8 7.62,6.35; 23/A9 7.62,8.89; AGND 7.62,13.97; GND -7.62,16.51; VIN 7.62,16.51
3362_BOURNS_TRIMPOT = drill 1: P$1 0,2.54; P$2 -2.54,0; P$3 2.54,0
3PINBATTERY_CLIP_WIDER = drill 1.8: P$1 -22.87,12; P$2 -15.25,14.54; P$3 -15.25,9.46; P$4 15.25,14.54; P$5 15.25,9.46; P$6 22.87,12; P$7 -22.87,-12; P$8 -15.25,-9.46; P$9 -15.25,-14.54; P$10 15.25,-9.46; P$11 15.25,-14.54; P$12 22.87,-12
POLOLU_D24V50F5 = drill 1.02: EN -3.175,-8.89; OUT 6.985,-8.89; VIN -0.635,-8.89 | drill 1.02 square: GND1 1.905,-8.89; GND2 4.445,-8.89 | drill 2.18: P$6 -6.731,-8.001; P$7 6.731,8.001
VISHAY_VEML6030_2X2X0.87 = smd 0.55 x 0.3: 1 -0.875,0.65; 2 -0.875,0; 3 -0.875,-0.65; 4 0.875,-0.65; 5 0.875,0; 6 0.875,0.65

### Placement (x,y rotation side)
C1  24.52,56.84 90 top
C2  48.98,17.62 0 top
C5  33.85,51.02 0 bottom
C6  25.94,51.15 180 top
C7  37.83,51.01 180 bottom
C8  15.4,43.03 0 top
C9  42.81,63.8 0 top
C10  14.41,46.04 90 top
C11  78.18,43.18 270 top
C12  71.5,63.75 306 top
C13  54,76.47 342 top
C14  32.36,76.47 18 top
C15  14.86,63.75 54 top
C16  8.18,43.18 90 top
C17  14.86,22.61 126 top
C18  32.36,9.89 162 top
C19  54,9.89 198 top
C20  71.5,22.61 234 top
C21  78.18,43.18 270 bottom
C22  71.5,63.75 234 bottom
C23  54,76.47 198 bottom
C24  32.36,76.47 162 bottom
C25  14.86,63.75 126 bottom
C26  8.18,43.18 90 bottom
C27  14.86,22.61 54 bottom
C28  32.36,9.89 18 bottom
C29  54,9.89 342 bottom
C30  71.5,22.61 306 bottom
C31  46.54,42.43 270 top
C32  44.5,42.42 270 top
C35  42.04,17.2 270 top
C36  43.94,17.2 270 bottom
C37  46.23,17.2 90 bottom
C41  68.66,36.76 90 top
C42  38.9,72.3 180 top
C43  42.89,72.32 0 top
DIN1  56,70.46 90 top
DIN2  54.11,70.45 90 top
DIN/OUT  30.58,45.82 270 top
FERRITE2  58.27,50.97 0 bottom
FRONT_OUT  68.58,49.99 90 top
J7  42.77,76.91 180 bottom
J12  23.57,26.53 90 bottom
JMP1  28.14,50.09 270 bottom
LED1  81.68,43.18 90 top
LED2  74.33,65.81 126 top
LED3  55.08,79.8 162 top
LED4  31.28,79.8 198 top
LED5  12.03,65.81 234 top
LED6  4.68,43.18 270 top
LED7  12.03,20.55 306 top
LED8  31.28,6.56 342 top
LED9  55.08,6.56 18 top
LED10  74.33,20.55 54 top
LED11  81.68,43.18 90 bottom
LED12  74.33,65.81 54 bottom
LED13  55.08,79.8 18 bottom
LED14  31.28,79.8 342 bottom
LED15  12.03,65.81 306 bottom
LED16  4.68,43.18 270 bottom
LED17  12.03,20.55 234 bottom
LED18  31.28,6.56 198 bottom
LED19  55.08,6.56 162 bottom
LED20  74.33,20.55 126 bottom
MCLK  28.61,65.57 90 top
MEMS1  41.48,47.69 0 bottom
MEMS2  41.54,41.56 0 top
P2  42.54,11.44 90 top
R1  15.41,40.74 0 top
R2  41.81,51.49 180 bottom
R3  46.28,56.6 90 top
R4  43.76,56.62 90 top
R5  34.42,65.42 90 top
R6  39.89,75.32 90 top
R7  49.31,55.63 0 top
R8  48.94,15.51 0 top
R9  42.48,45.46 0 top
R10  43.02,14.51 180 bottom
R11  44.01,77.13 180 top
REAR_OUT  68.58,44.81 270 bottom
S3  43.13,11.48 180 top
SW1  15.34,45.42 270 top
U2  42.83,61.38 0 top
U3  45.09,17.2 0 top
U$1  32,36.68 90 top
U$2  52.58,36.68 180 top
U$3  43.3,60.93 270 top
U$4  17.24,28.05 90 top
U$5  43.18,43.18 90 bottom
U$6  17.24,58.06 90 top
U$8  43.18,12.29 180 top
VMEL1  15.39,43.12 180 bottom
VMEL2  42.93,74.93 180 top

### Tracks (layer width: path | path; a pad name or v marks a point on that pad's centre or on a via)
3.3V  (via drill 0.51, 0.65, 0.85, 0.9, 1)
  Top 0.305: R8.2 49.94,14.79 47.55,12.39 44.04,12.39 43.6,12.83 43.6,12.88 42.98,13.5 42.58,13.5 39.73,16.35 37.71,16.35 36.75,17.31 30.2,17.31 25.76,21.75 | v34.85,49.48 34.85,48.9 34.57,48.62 34.57,47.59 36.71,45.45 36.71,43.76 v36.88,43.59 | R1.2 16.46,40.74 16.46,35.59 arc45 17.27,33.63 20.93,29.97 21.23,29.97 21.82,29.77
  Top 0.406: MEMS2.2 37.69,42.81 | 37.69,42.81 37.45,42.81 36.88,43.38 | v46.05,44.61 46.55,44.11 C31.1 C32.1 44.23,43.64 MEMS2.5 | v42.4,39.91 arc-45 39.32,41.19 37.69,42.81
  Top 0.61: v42.72,78.69 42.72,77.47 R11.2 | v43.8,59 43.76,58.97 R4.2 | v46.32,58.97 46.28,58.93 R3.2 | U$4.P$2 21.59,25.51 21.8,25.3 21.82,25.28 | 40.18,62.05 40.18,62.1 40.17,62.11 C9.1 41.9,63.75 U2.1 40.35,61.88 40.18,62.05 | 40.18,62.05 v40.18,60.63 | 36.88,43.38 v36.88,43.59
  Top 0.813: U$6.P$2 17.24,58.75 v17.17,58.83
  Top 0.914: v26.9,60.84 26.9,61.12 25.72,62.29 arc45 v22.32,63.7 | v38.09,76.25 arc-45 38.16,76.32 R6.2 arc-45 41.33,77.75 42.45,77.75 R11.2
  Top 1.27: 21.8,25.3 21.8,24.03 arc90 24.08,21.75 25.76,21.75 arc90 28.19,24.19 U$1.3.3 | v23.42,31.17 22.02,29.77 21.82,29.77 21.82,25.28 | v57.93,60.85 58.11,60.67 58.65,60.67 59.96,59.36 59.96,57.5 58.65,56.19 57.61,56.19 U$3.3.3V | v53.95,46.84 v50.49,46.84 | C31.1 47.77,44.6 v48.26,44.6
  Bottom 0.305: 46.27,44.57 46.08,44.57 v46.05,44.61 | v34.85,49.48 34.85,51.02
  Bottom 0.406: v46.05,44.61 46.05,43.55 v42.4,39.91 | C5.1 34.85,51.02 C7.1 36.88,50.7 37.82,49.76 MEMS1.5
  Bottom 0.61: J7.4 42.67,78.74 v42.72,78.69 | v46.32,58.97 46.07,58.72 44.08,58.72 v43.8,59 42.17,60.63 v40.18,60.63
  Bottom 0.813: v17.17,58.83 17.53,59.18 17.83,59.18 18.66,60.01 18.66,60.49 21.87,63.7 v22.32,63.7
  Bottom 0.914: v26.9,60.84 27.11,60.63 36.27,60.63 v40.18,60.63 | v22.32,63.7 arc45 22.7,64.61 22.7,66.38 arc-90 29.77,73.46 34.93,75.75 35.44,76.25 arc45 v38.09,76.25
  Bottom 1.27: v57.93,60.85 57.83,60.95 57.6,60.95 57.4,60.75 36.46,60.75 36.3,60.59 36.27,60.63 34.69,60.63 34.65,60.67 27.07,60.67 v26.9,60.84 | U$3.3.3V 54.73,49.03 54.74,49.02 54.74,47.63 v53.95,46.84 | v50.49,46.84 v48.26,44.6 | v48.26,44.6 46.3,44.6 46.27,44.57 | v48.26,44.6 48.03,44.38 48.03,40.52 46.16,38.65 arc-45 36.51,34.65 28.82,34.65 arc45 25.54,33.29 v23.42,31.17
5V  (via drill 1)
  Top 0.813: LED6.1-VDD 4.22,40.83 5.48,42.09 8.04,42.09 C26.1 | LED7.1-VDD 13.24,18.84 13.24,20.06 14.32,21.14 14.72,21.14 C27.1 | LED8.1-VDD 33.01,6.32 arc-90 32.33,7 32.33,7.84 33.27,8.78 C28.1 | C29.1 55.34,9.74 55.34,9.26 arc45 56.1,7.43 56.11,7.43 v56.46,7.08 LED9.1-VDD | C20.1 72.47,23.38 73.46,22.39 arc45 74.64,21.9 76.62,21.9 LED10.1-VDD | LED1.1-VDD 82.44,45.53 81.48,44.57 arc-45 80.76,44.27 78.32,44.27 C21.1 | LED2.1-VDD v73.12,67.52 73.12,66.71 arc-45 72.83,66.02 72.04,65.22 arc45 71.35,64.94 C22.1 | C25.1 13.89,62.98 12.41,64.46 9.74,64.46 LED5.1-VDD | C6.1 26.64,51 26.64,50.44 25.76,49.55 25.05,49.55 25.02,49.52 v24,49.52
  Top 1.27: C1.+ 24.04,56.33 23.89,56.33 17.94,62.28 | C25.1 15.01,62.28 17.94,62.28 | v57.66,16.15 57.66,14.18 arc-45 56.78,12.07 C29.1 | C20.1 71.67,23.76 70.96,23.76 v67.04,27.68 | C21.1 71.61,50.7 arc-45 70.41,53.6 70.41,58.48 arc45 v68.58,62.89 C22.1 | v58.59,72.88 54.38,74.25 arc-90 C23.1 53.09,76.85 53.35,77.11 53.35,77.35 arc45 54.22,79.46 v54.22,79.55 54.22,80.14 53.35,81.01 LED3.1-VDD 52.46,81.2 51.76,81.2 49.39,82.46 arc38 38.14,84.28 34.19,83.6 arc72 31,83.1 LED4.1-VDD 30,79.18 v30.37,79.18 31.46,78.08 C24.1 30.65,76.17 18.78,64.31 arc45 17.94,62.28 | 17.18,23.25 14.12,26.31 14.12,26.38 10.77,29.73 arc-45 9.24,33.42 9.24,39.66 arc45 C26.1 7.77,42.64 6.3,42.64 5.18,43.76 | C28.1 33.27,9.9 33.83,10.46 v33.83,16.15 | C27.1 15.58,21.84 16.99,23.25 17.18,23.25 | C25.1 14.31,62.7 12.24,60.63 arc45 11.29,58.34 arc-45 8.8,52.32 6.73,50.25 arc45 4.75,45.47 4.75,44.2 5.18,43.76 | C41.+ 75.07,47.17 75.07,41.91 arc45 75.75,40.28 77.5,38.53 77.55,38.53 78.32,37.76 arc-45 79.9,33.94 79.9,28.39 arc-45 LED10.1-VDD 75.9,21.48 v75.45,21.93 | v36.8,30.54 | v36.8,30.54 arc45 35.94,32.62 26.42,42.14 26.34,42.22 26.27,42.22 23.56,44.93 v23.56,45.18 | v81.75,45.26 83.05,45.26 LED1.1-VDD | v32.74,6.05 33.01,5.78 LED8.1-VDD | v12.97,19.42 12.97,18.57 LED7.1-VDD | v5.18,42.77 5.18,43.76 | v12.49,64.56 13.01,64.04 13.18,64.04 14.23,62.98 C25.1 | 17.18,23.25 17.19,23.25 v24.28,16.15
  Bottom 0.813: LED18.1-VDD C28.1 | C29.1 LED19.1-VDD | C20.1 LED20.1-VDD | C21.1 LED11.1-VDD | C22.1 LED12.1-VDD | C23.1 LED13.1-VDD | C24.1 LED14.1-VDD | C25.1 LED15.1-VDD | C26.1 LED16.1-VDD | C27.1 LED17.1-VDD
  Bottom 1.27: U$2.5V 57.66,20.42 | 57.66,20.42 v57.66,16.15 | v58.59,72.88 v68.58,62.89 68.58,62.08 U$3.VIN | v24.28,16.15 v33.83,16.15 36.2,18.52 U$8.OUT | v36.8,30.54 37.04,30.78 63.94,30.78 v67.04,27.68 arc45 65.81,24.71 65.81,22.63 arc-90 63.59,20.42 57.66,20.42 | LED12.1-VDD 72.34,66.74 v73.12,67.52 | LED11.1-VDD 81.48,45.53 v81.75,45.26 | LED20.1-VDD 75.45,22.35 v75.45,21.93 | LED19.1-VDD 56.8,7.42 v56.46,7.08 | LED18.1-VDD 32.74,6.12 v32.74,6.05 | LED17.1-VDD 14.55,19.42 v12.97,19.42 | LED16.1-VDD 5.18,41.98 v5.18,42.77 | LED15.1-VDD 11.99,64.06 v12.49,64.56 | LED14.1-VDD 30.37,78.31 v30.37,79.18 | LED13.1-VDD 52.93,79.55 v54.22,79.55 | v23.56,45.18 v23.56,45.19 23.56,48.92 23.9,49.27 23.9,49.49 23.92,49.52 v24,49.52 24.25,49.76 24.25,55.57 C1.+
*PB
  Bottom 0.305: S3.3 45.08,12.44 44.2,12.44 | 44.2,12.44 P2.2 | R10.2 44.02,12.61 44.2,12.44
_BCLK
  Top 0.61: U$3.9 34.42,68.53 R5.2
_BUT1  (via drill 0.35)  (1 unrouted)
  Top 0.203: DIN1.2 55.63,70.97 54.98,71.61 52.42,71.61 50.7,69.89 50.7,67.65 v50.6,67.55 | v25.5,53.54 23.27,53.54 v23.06,53.34 | v22.25,54.97 19.18,51.9
  Bottom 0.203: v50.6,67.55 50.1,67.06 35.26,67.06 30.68,62.48 26.14,62.48 25.22,61.57 25.22,60.34 26.08,59.49 26.08,55.71 26.54,55.26 26.54,54.75 25.5,53.72 v25.5,53.54 | v23.06,53.34 22.25,54.15 v22.25,54.97
_BUT2  (via drill 0.35)
  Top 0.203: DIN2.2 54.05,70.9 52.41,70.9 51.11,69.6 51.11,67.93 51.23,67.81 51.23,67.23 v51.51,66.95 | v26.72,56.59 25.5,57.81 25.5,58.25 24.68,59.07 23.53,59.07 21.95,60.66 v21.23,60.66
  Bottom 0.203: v51.51,66.95 51.2,66.64 35.55,66.64 30.99,62.08 26.31,62.08 25.63,61.4 25.63,60.53 26.72,59.44 v26.72,56.59 | v21.23,60.66 20.75,60.17 20.75,52.52 20.96,52.31 20.96,51.44 20.75,51.23 20.75,50.83 SW1.11
_LRCLK
  Top 0.305: U$3.23/A9 52.19,53.53 50.26,55.46 R7.2
AGND  (via drill 0.65, 0.85)
  Top 0.61: v44.81,39.52 44.86,39.58 v49.94,39.58 | v25.7,36.07 v25.7,30.99
  Bottom 0.61: v25.7,36.07 36.47,36.07 arc45 v44.81,39.52 | FERRITE2.2 55.98,49.69 55.98,46.43 49.94,40.39 v49.94,39.58 | v25.7,30.99 25.7,27.84 U$1.AGND J12.2
  Bottom 1.27: U$3.AGND FERRITE2.2
AMP_FAULT  (via drill 0.3, 0.35)
  Top 0.203: v33.22,49.58 34.34,50.7 34.34,53.24 U$3.16/A2 | U$2.FAULT 60.2,33.17 v60.25,33.22 | v37.49,33 28.64,41.85 v28.46,41.85
  Bottom 0.203: v33.22,49.58 32.92,49.28 32.82,49.28 31.9,48.36 31.9,45.01 28.6,41.71 v28.46,41.85 | v60.25,33.22 60.02,33 v37.49,33
AMP_SD  (via drill 0.35)
  Top 0.203: U$2.SD 44.96,33.58 v45.01,33.63
  Bottom 0.203: U$3.20/A6 44.6,53.24 45.62,53.24 50.9,47.95 51,47.95 51.61,47.35 51.61,43.59 49.13,41.11 49.13,38.54 45.12,34.52 45.12,33.74 v45.01,33.63
BAT+
  Top 0.406: C35.1 42.14,18.17 U3.1 43.81,18.3 U$8.VIN
  Top 1.778: U$8.VIN 44.5,21.87 44.5,21.95 45.81,23.27 55.17,23.27
  Top 2.54: U$5.P$1 55.17,23.27 55.17,27.53 U$5.P$3 U$5.P$2
  Bottom 1.778: U$8.VIN 44.5,21.87 44.5,21.95 45.81,23.27 55.18,23.27
  Bottom 2.54: U$5.P$2 55.37,27.93 | 55.37,27.93 U$5.P$3 | U$5.P$1 55.18,23.27 55.18,27.74 55.37,27.93
BCLK  (via drill 0.3, 0.51)
  Top 0.203: MEMS2.4 43.15,42.81 v43.19,42.77
  Top 0.305: v37.53,62.16 37.57,62.12 37.57,59.38 arc45 39.31,55.19 40.27,54.23 arc-45 40.66,53.29 40.66,51.86 arc-45 39.95,50.14 38.97,49.16 arc45 38.53,48.11 U$1.I2S_BCLK | R5.1 v36.48,64.47
  Bottom 0.203: v43.19,42.77 43.18,42.77 38.35,47.6 U$1.I2S_BCLK 39.75,48.11 MEMS1.4
  Bottom 0.305: v36.48,64.47 36.48,64.27 36.52,64.23 36.52,63.55 37.53,62.53 v37.53,62.16
BUT1
  Top 0.203: DIN1.1 56,69.81 U$3.0
BUT2
  Top 0.203: DIN2.1 54.73,69.33 U$3.1
BUT3  (1 unrouted)
  Bottom 0.203: 19.2,46.84 21.84,49.48 21.84,54.48 21.62,54.7 21.62,55.23 21.84,55.45 21.84,59.54 30.38,68.07 30.38,68.68 35.97,74.27 36.58,74.27 36.9,73.94 36.9,70.17 38,69.07 38,68.48 39.01,67.46 45.01,67.46 46.02,68.48 47.04,68.48 U$3.4
BUT4  (via drill 0.3)  (1 unrouted)
  Top 0.203: v21.23,49.78 21.23,46.33 19.2,44.3
  Bottom 0.203: U$3.6 42.32,68.84 42.32,72.8 40.45,74.68 35.36,74.68 30.28,69.6 28.85,69.6 27.84,68.58 27.84,66.14 21.21,59.52 21.21,54.53 21.37,54.38 21.37,51.27 21.23,51.14 v21.23,49.78
BUT5  (via drill 0.3)  (1 unrouted)
  Top 0.203: v25.93,55 25.73,54.8 23.06,54.8 21.84,53.59 21.84,44.4 19.2,41.76
  Bottom 0.203: U$3.8 36.13,68.55 30.47,62.89 25.9,62.89 24.82,61.81 24.82,60.18 25.66,59.34 25.66,55.27 v25.93,55
BUT6  (via drill 0.3)  (1 unrouted)
  Top 0.203: v31.29,55.18 30.48,54.37 23.2,54.37 22.25,53.42 22.25,42.27 19.2,39.22
  Bottom 0.203: v31.29,55.18 31.29,53.64 31.35,53.58 U$3.15/A1
DIN  (via drill 0.35)
  Top 0.305: v35.38,55.39 35.29,55.39 34.2,56.48 v34.17,56.48 | v27.69,45.88 28.82,45.88 DIN/OUT.3
  Bottom 0.305: U$3.22/A8 48.19,54.76 44.15,54.76 43.79,55.13 43.02,55.13 42.98,55.17 41.3,55.17 41.02,55.45 35.44,55.45 v35.38,55.39 | v34.17,56.48 34.05,56.59 30.53,56.59 28.14,54.2 28.14,53.07 26.44,51.37 JMP1.1 26.92,49.61 26.92,46.65 v27.69,45.88
DOUT  (via drill 0.35, 0.51)
  Top 0.305: v31.24,50.06 32,49.31 32,47.48 32.28,47.2 DIN/OUT.1 32.28,45.45 v33.43,44.3 | U$3.13 28.22,51.87 v28.22,51.85 | v45.28,45.3 43.59,45.3 R9.2
  Top 0.406: R9.2 43.43,47.35 arc-45 44.17,49.13 45.73,50.69 v45.73,50.75
  Bottom 0.203: 33.38,44.25 33.85,43.77 arc45 36.49,42.68 42,42.68 42.52,42.16 43.79,42.16 45.28,43.65 v45.28,45.3
  Bottom 0.305: v31.24,50.06 31.21,50.09 JMP1.3 29.77,50.09 29.36,50.49 29.36,51.31 28.82,51.85 v28.22,51.85 | 33.38,44.25 v33.43,44.3
  Bottom 0.406: v45.73,50.75 45.6,50.88 43.18,50.88 43.18,51.72 42.99,51.72 R2.2
EN
  Top 0.203: U$8.EN 46.35,19.54 45.31,18.5 45.31,17.19 45.49,17.01 45.51,17.01 45.67,16.85 46.21,16.85 U3.6
GND  (via drill 0.35, 0.45)
  Top 0.203: C31.2 C32.2 44.4,41.47 41.63,41.47 | 39.5,41.8 39.74,41.56 MEMS2.P$1
  Top 0.406: C43.2 43.84,74.24 VMEL2.1 43.71,74.37 43.27,74.37 42.96,74.68 42.96,75.27 42.64,75.59 VMEL2.4 | 17.52,43.27 16.37,43.27 | v16.98,44.44 16.91,44.52 | C31.2 44.4,41.47 | C32.2 41.63,41.47 MEMS2.P$1
  Top 0.61: U2.5 42.83,62.58 | 42.83,62.58 43.07,62.81 43.07,63.11 C9.2 | U2.4 43.05,62.58 42.83,62.58 | C26.2 7.92,44.13 6.52,45.53 LED6.3-GND | 39.12,20.62 39.12,20.8 U$8.GND2
  Top 0.813: C22.2 LED2.3-GND | C21.2 LED1.3-GND | LED10.3-GND C30.2 | C29.2 LED9.3-GND | C28.2 LED8.3-GND | C27.2 LED7.3-GND
  Top 1.27: U$8.GND2 U$8.GND1
  Top 2.032: U$5.P$7 32.69,18.8 37.69,18.8 39.12,20.22 39.12,20.62
  Top 2.54: U$5.P$8 U$5.P$9
  Bottom 0.305: VMEL1.1 15.25,42.47 15.64,42.87 15.64,43.42 15.99,43.77 16.23,43.77 16.24,43.77 VMEL1.4 16.36,43.87 16.55,43.87 17.05,44.37 v16.98,44.44 | 16.64,43.77 17.01,43.77
  Bottom 0.406: MEMS1.2 41.48,48.04 MEMS1.P$1
  Bottom 0.61: J7.6 40.47,84.9 40.34,85.04 | 40.34,85.04 37.74,85.04 arc90 36.17,83.47 J7.S1 | LED14.3-GND 33.14,82.22 36.09,82.22 | 40.34,85.04 47.74,85.04 arc-90 49.52,83.25 J7.S2
  Bottom 0.813: U$1.GND J12.1
  Bottom 1.27: C30.2 70.27,22.5 69.72,22.5 69.66,22.44 | U$2.GND 62.05,23.4 arc45 64.2,22.5
  other vias: 32.61,43.79 35.01,44.61 35.97,44.67 33.02,43.18 33.63,42.57 72.74,51.92 73.76,51.92 73.76,50.9 73.76,52.94 72.74,52.94 71.73,52.94 57.3,75.29 58.32,75.29 58.32,74.48 51.41,84.23 52.63,84.23 51.41,83.21 18.08,74.68 19.3,74.68 18.08,73.46 7.52,48.67 7.52,47.45 8.13,46.23 4.06,30.79 5.49,30.79 5.49,29.36 5.49,32.21 4.06,32.21 27.84,13.72 28.85,13.72 29.87,13.72 27.84,12.7 28.85,12.7 29.87,12.7 20.02,56.59 20.02,55.58 19,55.58 19,56.59 19.61,63.09 20.42,63.91 21.23,64.72 17.98,66.14 18.8,66.95 19.61,67.77 34.35,45.23 72.58,25.34 73.6,25.34 74.61,25.34 56.32,14.77 56.32,13.75 55.31,13.75 55.31,14.77 17.31,21.27 16.5,20.46 17.51,19.65 2.68,52.36 2.48,51.34 2.27,50.33 8.98,61.71 9.59,62.52 10.2,63.33 76.44,43.62 76.44,42.61 76.44,41.59 40.37,44.43 24.19,60.41 23.62,59.88 24.38,59.7 15.89,61.02 14.99,61.06 15.42,60.3 38.47,52.28 33.18,62.04 34.4,62.04 34.4,63.05 33.18,63.05 26.88,63.66 35.22,70.57 34.2,70.57 30.75,71.99 31.76,71.99 31.76,73.01 23.01,55.47 22.5,56.07 37.76,70.97 41.62,70.56 41.42,65.48 42.44,65.48 51.38,62.23 52.39,62.23 51.38,63.25 52.39,63.25 47.11,74.83 48.13,74.83 48.13,73.81 47.11,73.81 37.56,65.28 38.57,65.28 30.14,55.13 31.96,55.73 30.82,55.9 33.66,55.76 31.6,42.37 30.78,41.35 31.8,40.34 32.61,41.35 23.88,42.37 23.88,41.35 23.88,40.13 28.55,32.61 28.55,31.6 29.77,31.6 29.77,32.61 66.24,62.69 65.43,61.88 65.43,63.71 68.48,59.84 67.66,59.03 68.68,58.83 70.31,72.04 71.32,71.43 29.46,47.23 29.44,48.79 27.59,44.35 28.6,44.35 29.62,44.35 31.07,51.02 30.34,51.43 72.74,47.25 71.93,48.06 71.12,48.87 61.37,44.81 61.37,43.79 60.35,44.81 60.35,43.79 73.76,43.18 73.76,42.17 73.76,40.95 38,17.38 39.01,17.38 40.03,17.38 33.73,18.19 32.71,18.19 31.7,18.19 29.67,23.68 30.68,23.68 28.04,21.03 29.06,21.03 25.81,20.42 24.79,20.42 25.81,19.41 19.1,23.68 20.12,23.68 20.12,24.49 19.1,24.49 20.52,26.52 19.51,26.52 19.51,27.54 20.52,27.54 41.54,76.57
  pour Top: 43.8,86.21 42.61,86.21 arc90 -0.05,43.54 -0.05,42.86 arc90 42.76,0.05 43.45,0.05 arc90 86.46,43.06 86.46,43.55 arc90
  pour Top: 86.36,43.73 86.36,43.23 arc-90 43.13,0 42.72,0 arc-90 0,42.72 0,43.31 arc-90 43.02,86.33 43.76,86.33 arc-90
  pour Bottom: 86.36,43.63 86.36,42.92 arc-90 43.44,0 42.96,0 arc-90 0,42.96 arc-90 43.48,86.44 43.56,86.44 arc-90
I2S_DIN
  Bottom 0.406: U$1.I2S_DIN 28.14,48.16 JMP1.2
I2S_DOUT
  Top 0.305: U$1.I2S_DOUT 30.73,45.97 DIN/OUT.2
I2S_MCLK
  Top 0.305: MCLK.1 28.61,60.92 26.82,59.13 26.82,57.64 27.87,56.59 32.21,56.59 32.96,55.84 32.96,51.2 32.54,50.78 32.54,48.84 U$1.I2S_MCLK
LOUT+
  Top 0.61: U$2.LIN+ 40.26,25.25 38.91,23.9 35.26,23.9 33.91,25.25 U$1.LOUT+
LOUT-  (via drill 0.65)
  Top 0.61: v42.77,24.08 40.24,24.08 39.25,23.09 32.89,23.09 U$1.LOUT-
  Bottom 0.61: v42.77,24.08 43.61,24.92 43.61,25.8 44.4,26.59 45.52,26.59 46.86,25.25 U$2.LIN-
LRCLK  (via drill 0.3)
  Top 0.203: MEMS2.1 39.88,43.64 v39.73,43.79 | 44.03,50.25 44.09,50.3
  Top 0.305: v39.73,43.79 39.73,44.12 39.69,44.15 39.69,45.92 38.85,46.76 | U$1.I2S_LRCLK 37.16,46.76 38.85,46.76 | 38.85,46.76 41.91,49.82 v43.61,49.82 44.03,50.25 | 44.09,50.3 45.39,51.61 47.49,51.61 48.33,52.45 48.33,53.65 48.36,53.68 R7.1
  Bottom 0.203: MEMS1.1 42.45,49.82 v43.61,49.82
MCLK
  Top 0.305: MCLK.2 29.3,68.57 U$3.11
MISO  (via drill 0.65)
  Top 0.305: U$3.12 28.85,70.61 32.21,70.61 34.52,72.92 34.52,77.72 38.22,81.42 v39.4,81.42
  Bottom 0.61: v39.4,81.42 39.4,83.23 J7.7
MOSI  (via drill 0.51)
  Top 0.305: U$3.7 38.51,68.55 35.57,71.48 35.57,77.3 38.03,79.76 v43.75,79.76
  Bottom 0.406: J7.3 43.77,79.78 v43.75,79.76
N$1
  Bottom 0.406: R2.1 41.48,50.87 MEMS1.6
N$2
  Top 2.54: U$5.P$11 31.19,58.43 | 31.19,58.43 U$5.P$10 | U$5.P$12 31.19,58.43 | U$5.P$5 55.17,58.43 | 55.17,58.43 U$5.P$4 | U$5.P$6 55.17,58.43
  Bottom 2.54: U$5.P$4 U$5.P$5 52.64,58.24 50.81,56.41 44.8,56.41 44.42,56.79 42.77,56.79 41.14,58.43 U$5.P$10
N$4  (via drill 0.45)
  Top 0.406: v13.17,42.92 13.24,43 14.41,43
  Top 0.813: R1.1 14.41,43 C8.1 14.45,45.3 C10.1
  Bottom 0.406: VMEL1.6 16.11,42.47 15.5,41.86 14.13,41.86 13.84,42.16 13.84,42.25 v13.17,42.92
N$6  (via drill 0.35)
  Top 0.203: U3.2 43.97,17.49 44.67,17.49 44.91,17.73 44.91,18.67 v44.91,19.21
  Bottom 0.203: v44.91,19.21 43.94,18.24 C36.1
  Bottom 0.305: R10.1 42.02,17.23 42.86,18.07 C36.1
N$9
  Top 0.61: LED2.4-DIN 80.44,59.28 arc-43 81.53,53.07 LED1.2-DOUT
N$10
  Top 0.61: LED3.4-DIN LED2.2-DOUT
N$11
  Top 0.61: LED4.4-DIN 38.24,82.98 arc-38 49.09,81.23 51.16,80.13 LED3.2-DOUT
N$12
  Top 0.61: LED5.4-DIN LED4.2-DOUT
N$13
  Top 0.61: LED6.4-DIN 3.63,52.25 arc-44 6.79,58.43 LED5.2-DOUT
N$14
  Top 0.61: LED7.2-DOUT LED8.4-DIN
N$15
  Top 0.406: LED8.2-DOUT 40.11,7.41 arc45 40.82,7.7 arc-90 45.33,7.7 47.58,5.46 arc45 49.77,4.55 53.07,4.55 LED9.4-DIN
N$16
  Top 0.61: LED10.4-DIN LED9.2-DOUT
N$17  (via drill 0.3)
  Top 0.406: LED10.2-DOUT 74.85,23.42 78.2,26.77 arc45 78.48,27.44 78.48,35.22 78.47,35.22 v78.47,35.24
  Bottom 0.406: v78.47,35.24 78.47,36.36 arc-45 78.63,36.73 arc45 79.66,39.23 79.66,40.46 LED11.4-DIN
N$18
  Bottom 0.61: LED11.2-DOUT 82.46,54.13 arc46 80.09,58.45 LED12.4-DIN
N$19
  Bottom 0.406: LED14.4-DIN 34.28,78.95 arc45 37.89,77.46 38.68,77.46 40.31,75.83 48.52,75.83 50.17,77.47 arc45 50.28,77.73 50.28,78.14 arc-45 50.89,79.63 LED13.2-DOUT
N$20
  Bottom 0.61: LED14.2-DOUT LED15.4-DIN
N$21
  Bottom 0.61: LED15.2-DOUT 6.29,60.2 arc48 4.85,51.12 LED16.4-DIN
N$23
  Bottom 0.61: LED12.2-DOUT LED13.4-DIN
N$24
  Top 0.61: LED6.2-DOUT LED7.4-DIN
N$26
  Bottom 0.406: LED18.2-DOUT 36.16,7.42 40.95,7.42 41.96,8.43 44.4,8.43 45.62,7.21 52.14,7.21 LED19.4-DIN
N$28
  Top 0.203: R9.1
  Top 0.406: MEMS2.6 R9.1
N$29
  Bottom 0.406: LED19.2-DOUT LED20.4-DIN
N$30
  Top 1.27: REAR_OUT.2 68.52,43.87 64.44,43.87 U$2.ROUT-
N$31
  Bottom 1.27: REAR_OUT.1 68.58,46.34 63.54,46.34 63.41,46.2 58.55,46.2 57.66,47.09 U$2.ROUT+
N$32
  Top 1.27: FRONT_OUT.2 68.15,51.42 51.02,51.42 arc45 46.33,49.48 U$2.LOUT-
N$33
  Top 1.27: U$2.LOUT+ arc-45 51.56,49.79 66.41,49.79 67.21,48.99 FRONT_OUT.1
N$41
  Top 0.406: R6.1 39.93,74.28 VMEL2.6 41.94,74.17 C43.1
  Top 1.27: R6.1 39.89,72.34 | 39.89,72.34 C42.1 | C43.1 39.91,72.32 39.89,72.34
N$43
  Bottom 0.61: LED17.2-DOUT LED18.4-DIN
NEO_PIX1  (via drill 0.45, 0.51)
  Top 0.406: v78.54,39.73 80.66,39.73 arc45 LED1.4-DIN | v52,54.91 51.45,55.45 51.45,56.59 51.14,56.9 49.85,56.9 45.76,60.99 45.76,64.84 44.57,66.03 U$3.5 | v60.18,55.61 62.25,55.61 v64.92,52.93 | v65.33,48.46 65.94,47.85 70.41,47.85 v72.03,46.23
  Bottom 0.406: v60.18,55.61 52.69,55.61 v52,54.91 | v64.92,52.93 64.92,48.87 v65.33,48.46 | v72.03,46.23 75.71,42.55 75.71,41.29 76.14,40.86 77.41,40.86 v78.54,39.73
NEO_PIX1_OUT
  Bottom 0.61: LED16.2-DOUT LED17.4-DIN
ONT  (via drill 0.35)
  Top 0.203: U3.3 44.08,16.73 44.68,16.73 44.94,16.47 44.94,15.15 v45.15,14.93
  Bottom 0.203: C37.1 46.09,16.32 45.15,15.38 v45.15,14.93
PDT
  Top 0.406: U3.7 48.01,17.52 C2.1
POT1  (via drill 0.3)
  Top 0.203: v36.98,48.87 36.98,53.24 U$3.17/A3
  Bottom 0.203: v36.98,48.87 36.98,47.65 35.26,45.92 33.43,45.92 24.78,37.27 arc-45 19.66,35.15 arc90 14.73,30.23 14.73,28.14 U$4.P$1
POT2  (via drill 0.3)
  Top 0.203: v53.98,43.18 v52.7,44.45 | v46.19,28.3 46.19,29.83 45.73,30.29 v45.73,34.21
  Bottom 0.203: v52.7,44.45 52.7,46.99 46.99,52.7 U$3.21/A7 | v45.73,34.21 50.92,39.4 50.92,40.13 v53.98,43.18 | v46.19,28.3 45.8,27.91 44.47,27.91 39.42,22.86 18.95,22.86 arc-45 16.95,23.69 14.73,25.91 arc-45 9.52,38.48 9.52,52.07 10.16,52.7 13.18,55.72 arc-45 13.56,55.88 arc90 14.61,56.93 14.61,57.78 U$6.P$1
PWR_INT  (via drill 0.51)
  Top 0.203: U$3.2 52.19,66.08 52.72,65.54 v53.15,65.54 | v62.48,58.62 65.13,55.98 v65.13,55.78 | v63.91,48.46 65.13,47.24 70.17,47.24 71.02,46.4 v71.02,45.41 | v63.72,32.21 63.19,31.68 63.19,24.91 arc-90 55.86,17.58 53.53,17.58 53.23,17.27 51.25,17.27 50.56,16.58 48.06,16.58 47.71,16.22
  Top 0.406: U3.5 47.71,16.22 R8.1
  Bottom 0.203: v62.48,58.62 62.48,58.99 58.99,62.48 56.21,62.48 v53.15,65.54 | v65.13,55.78 65.13,54.97 63.91,53.75 v63.91,48.46 | v71.02,45.41 71.05,45.39 71.05,44.87 arc-45 67.87,37.21 63.72,33.06 v63.72,32.21
PWR_KILL  (via drill 0.51)
  Top 0.203: U$3.3 49.65,67.5 53.04,64.11 v53.15,64.11 | v61.47,57.61 v64.11,54.97 | v62.89,47.45 63.5,46.84 69.8,46.84 70.31,46.33 v70.31,44.66 | v52.93,17.98 55.67,17.98 arc90 62.64,24.95 62.64,31.85 v62.28,32.21 | U3.8 47.26,19.2 v47.26,19.22
  Bottom 0.203: v53.15,64.11 53.95,64.11 55.98,62.08 58.83,62.08 61.47,59.44 v61.47,57.61 | v64.11,54.97 63.39,54.25 63.39,48.96 62.89,48.45 v62.89,47.45 | v70.31,44.66 70.31,44.63 70.53,44.63 arc-45 67.57,37.5 v62.28,32.21 | v47.26,19.22 48.49,17.98 v52.93,17.98
ROUT+
  Top 0.61: U$1.ROUT+ 39.17,26.06 43.87,26.06 44.4,26.59 48.69,26.59 U$2.RIN+
ROUT-  (via drill 0.65)
  Top 0.61: U$2.RIN- 51.94,25.25 49.78,27.41 44.06,27.41 43.71,27.06 v42.37,27.06
  Bottom 0.61: U$1.ROUT- 36.45,25.25 37.8,23.9 39.21,23.9 v42.37,27.06
SCL  (via drill 0.35)
  Top 0.203: VMEL2.5 41.9,75.08 40.81,75.08 40.63,75.26 39.15,75.26 38.1,74.21 38.1,73.86 37.59,73.36 37.18,73.36 36.92,73.1 36.92,70.85 37.95,69.83 40.04,69.83 40.56,69.31 40.56,64.7 arc-45 39.87,63.03 arc45 39.3,61.67 39.3,60.62 arc90 40.27,59.66 41.9,59.66
  Top 0.305: U$1.SCL 27.16,49.61 27.32,49.61 29.87,52.16 31.15,52.16 v31.39,51.92 | v40.74,54.76 41.9,54.76 | 41.88,55.66 41.88,53.45 U$3.19/A5
  Top 0.406: U2.2 41.9,59.66 41.9,54.76 41.9,54.47 41.91,54.47 41.91,53.43 U$3.19/A5 | 41.88,55.66 41.88,55.67 R4.1 43.76,55.66
  Bottom 0.203: VMEL1.5 16.36,43.08 24.93,43.08 26.92,45.07 26.92,45.92 25.7,47.14 25.7,48.06 U$1.SCL
  Bottom 0.305: v31.39,51.92 31.89,51.92 32.15,52.18 37.38,52.18 38.12,52.92 38.12,53.48 39.03,54.4 40.38,54.4 v40.74,54.76
SD_CS  (via drill 0.65)
  Top 0.305: U$3.10 31.87,69.46 35.05,72.64 35.05,77.5 38.11,80.56 v44.85,80.56
  Top 0.61: v44.85,80.56 44.66,80.37 44.66,77.44 R11.1
  Bottom 0.61: J7.2 44.87,80.56 v44.85,80.56
SDA  (via drill 0.3, 0.35, 0.51)
  Top 0.203: VMEL2.2 44.55,74.93 v44.6,74.88 | v43.14,69.33 43.14,66.66 45.21,64.58 45.21,60.45 44.8,60.03 44.59,60.03 | v49.38,48.06 49.38,42.47 47.35,40.44 44.5,40.44 43.18,39.12 37.76,39.12 arc-45 35.05,40.24 32.66,42.63 arc45 30.84,43.38 29.46,43.38 27.8,43.38 arc-45 26.66,43.85 25.65,44.86 U$1.SDA
  Top 0.305: 46.28,56.13 R3.1 45.1,55.64 45.04,55.7 | 44.59,60.03 U2.3 | 45.04,59.52 45.04,55.7 | v43.47,54.36 43.51,54.4 44.63,54.4 45.04,54.81 45.04,55.7
  Top 0.406: U2.3 43.75,60.81 45.04,59.52
  Bottom 0.203: VMEL1.2 14.86,43.12 15.18,43.43 arc-45 15.49,44.18 16.14,44.83 arc-45 17.75,45.5 19.66,45.5 arc-45 20.71,45.07 20.73,45.01 21.95,45.01 22.86,44.09 24.15,44.09 25.62,45.57 U$1.SDA | v44.6,74.88 arc90 42.84,73.12 42.84,69.62 v43.14,69.33 | v49.38,48.06 46.53,50.9 46.53,51 45.31,52.22 44.09,52.22 43.48,52.83 43.48,54.25 v43.47,54.36
  Bottom 0.406: v43.47,54.36 43.39,54.45 41.46,54.45 40.64,53.62 39.8,53.62 U$3.18/A4
SPI_CLK  (via drill 0.35, 0.51)
  Top 0.203: v35.46,56.55 35.46,56.59 35.58,56.63
  Top 0.305: v41.55,78.99 41.3,79.25 38.26,79.25 36.09,77.08 36.09,73.81 v36.27,73.63 | v32.16,54.75 31.81,54.4 31.41,54.4 30.32,53.3 U$3.14/A0 | v35.69,69.23 35.67,69.22 v35.67,65.42 | v35.58,61.98 35.58,56.63
  Bottom 0.305: J7.5 41.57,79.01 v41.55,78.99 | v36.27,73.63 36.36,73.54 36.36,69.81 35.73,69.19 v35.69,69.23 | v35.46,56.55 33.66,54.75 v32.16,54.75 | v35.67,65.42 35.67,62.07 v35.58,61.98

### Text on the board
tNames: ID
bValues: + | -